# EAGLE design ARTIC_R2_Module_Breakout (EAGLE 9.6.2)
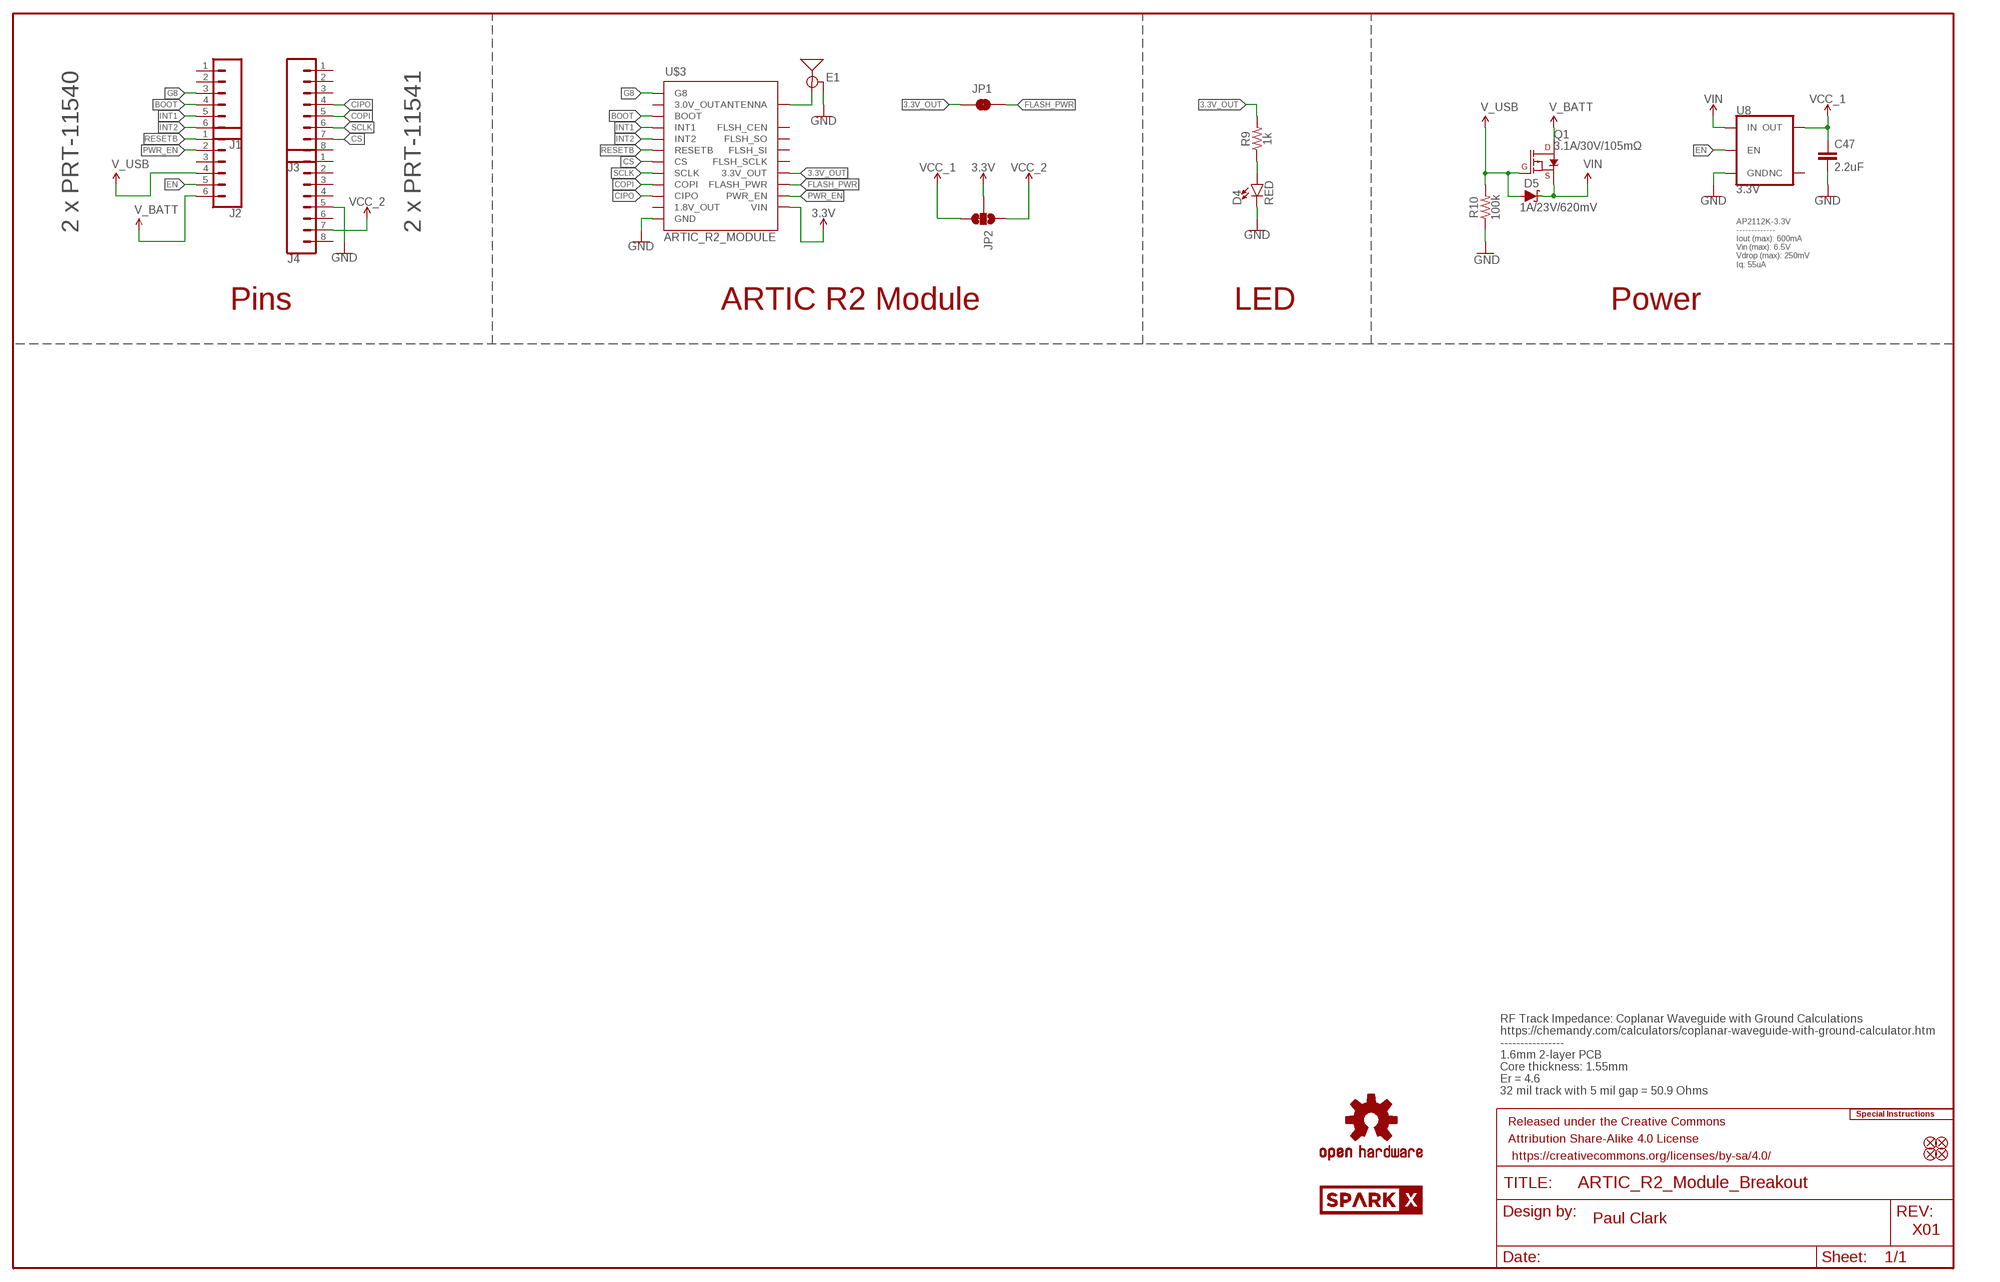
[diagram p0: schematic, sheet 1]

## Parts
C47  2.2uF  2.2UF-0402_TIGHT-10V-10%-X5R  [0402-TIGHT]
D4  RED  LED-RED0603  [LED-0603]
D5  1A/23V/620mV  DIODE-SCHOTTKY-BAT20J  [SOD-323]
E1  ANTENNA-SMA-GROUNDEDEDGE_SMA_SMD  [SMA-EDGE-SMD]
FD1  FIDUCIAL1X2  [FIDUCIAL-1X2]
FD2  FIDUCIAL1X2  [FIDUCIAL-1X2]
FD3  FIDUCIAL1X2  [FIDUCIAL-1X2]
FD4  FIDUCIAL1X2  [FIDUCIAL-1X2]
FRAME1  FRAME-LEDGER  [CREATIVE_COMMONS]
J1  CONN_06SMD_MALE  [1X06_SMD_MALE]
J2  CONN_06SMD_MALE  [1X06_SMD_MALE]
J3  CONN_08SMD-MALE  [1X08_SMD_MALE]
J4  CONN_08SMD-MALE  [1X08_SMD_MALE]
JP1  JUMPER-SMT_2_NC_TRACE_SILK  [SMT-JUMPER_2_NC_TRACE_SILK]
JP2  JUMPER-SMT_3_1-NC_TRACE_SILK  [SMT-JUMPER_3_1-NC_TRACE_SILK]
LOGO1  SPECIAL_INSTRUCTIONS-ORDERING  [ORDERING_INSTRUCTIONS]
LOGO2  OSHW-LOGOS  [OSHW-LOGO-S]
LOGO3  OSHW-LOGOS  [OSHW-LOGO-S]
Q1  3.1A/30V/105mΩ  MOSFET_PCH-DMG2307L  [SOT23-3]
R9  1k  1KOHM-0402T-1/16W-1%  [0402-TIGHT]
R10  100k  100KOHM-0402T-1/16W-1%  [0402-TIGHT]
SPARKX2  SPARKX-LOGO4  [SPARKX-MEDIUM]
U8  3.3V  V_REG_AP2112K-3.3V  [SOT23-5]
U$3  ARTIC_R2_MODULE  [ARTIC_R2_MODULE]

## Nets
3.3V: JP2.2 U$3.14(VIN)
3.3V_OUT: JP1.1 R9.2 U$3.17(3.3V_OUT)
ANTENNA: E1.SIG(SIGNAL) U$3.23(ANTENNA)
BOOT: J1.4 U$3.3(BOOT)
CIPO: J3.4 U$3.10(CIPO)
COPI: J3.5 U$3.9(COPI)
CS: J3.7 U$3.7(CS)
EN: J2.5 U8.3(EN)
FLASH_PWR: JP1.2 U$3.16(FLASH_PWR)
G8: J1.3 U$3.1(G8)
GND: C47.2 D4.C E1.GND@0(GND) E1.GND@1(GND) J4.5 R10.1 U8.2(GND) U$3.12(GND) U$3.13(GND) U$3.22(GND) U$3.24(GND)
INT1: J1.5 U$3.4(INT1)
INT2: J1.6 U$3.5(INT2)
N$22: D4.A R9.1
PWR_EN: J2.2 U$3.15(PWR_EN)
RESETB: J2.1 U$3.6(RESETB)
SCLK: J3.6 U$3.8(SCLK)
V_BATT: J2.6 Q1.3(D)
V_USB: D5.A J2.4 Q1.1(G) R10.2
VCC_1: C47.1 JP2.3 U8.5(OUT)
VCC_2: J4.7 JP2.1
VIN: D5.C Q1.2(S) U8.1(IN)
Unconnected: J1.1 J1.2 J2.3 J3.1 J3.2 J3.3 J3.8 J4.1 J4.2 J4.3 J4.4 J4.6 J4.8 U8.4(NC) U$3.2(3.0V_OUT) U$3.11(1.8V_OUT) U$3.18(FLSH_SCLK) U$3.19(FLSH_SI) U$3.20(FLSH_SO) U$3.21(FLSH_CEN)

## Notes on the sheet
- AP2112K-3.3V
  -------------
  Iout (max): 600mA 
  Vin (max): 6.5V
  Vdrop (max): 250mV
  Iq: 55uA
- 2 x PRT-11540 | 2 x PRT-11541
- Pins | ARTIC R2 Module | LED | Power
- RF Track Impedance: Coplanar Waveguide with Ground Calculations
  https://chemandy.com/calculators/coplanar-waveguide-with-ground-calculator.htm
  ----------------
  1.6mm 2-layer PCB
  Core thickness: 1.55mm
  Er = 4.6
  32 mil track with 5 mil gap = 50.9 Ohms
- Paul Clark
- X01

## Library data of the parts
C47 = SparkFun-Capacitors:2.2UF: 2.2µF ceramic capacitors A capacitor is a passive two-terminal electrical component used to store electrical energy temporarily in an electric field.; PROD_ID: CAP-14232
D4 = SparkFun-LED:LED-RED: Red SMD LED Used in manufacturing of most products at SparkFun Packages: 0603 - SMD 0603 package [Product Link] <http://docs.avagotech.com/docs/AV02-0551EN> 0603 SMART - SMD 0603 SMART package ( more efficient and expensive)[Product Link] <http://www.osram-os.com/Graphics/XPic2/00077099_0.pdf> 1206 - SMD1206 package [Product Link] <https://www.sparkfun.com/datasheets/DevTools/LilyPad/Q150OVS4.pdff> SparkFun Products: Pro Mini 328 -5V <https://www.sparkfun.com/products/821> RedBoard <https://www.sparkfun.com/products/12757> IOIO-OTG <https://www.sparkfun.com/products/13613>; PROD_ID: DIO-00819
D5 = SparkFun-DiscreteSemi:DIODE-SCHOTTKY: Schottky diode A Schottky diode is a semiconductor diode which has a low forward voltage drop and a very fast switching action.; PROD_ID: DIO-11623
E1 = SparkFun-RF:ANTENNA-SMA-GROUNDED: SMA Antenna Connector w/ Ground Edge-mount and SMD SMA connectors for RF Antennas. **4-LAYER BOARD WARNING!!** When designing a 4-layer board using any of the SMD variants, you will need to manually add a cutout polygon on any internal power layers to make sure that you don't end up with exposed copper around the edge of the routed hole for these connectors. Exposed power copper could then short to the connector body - and that would be bad. Why hasn't anyone added the cutout polygons directly to the connector footprint? Well, your internal layers (usually 2 and 15) may be covered with GND polygons and you might well want the copper to go all the way to the edge, especially under the connector SIGNAL pin. So adding cutouts to the footprint might make matters worse, not better...; PROD_ID: CONN-15100
FD1-FD4 = SparkFun-Aesthetics:FIDUCIAL: Fiducial Alignment Points Point-of-reference for pick-and-place machines and other optical instruments.
FRAME1 = SparkFun-Aesthetics:FRAME-LEDGER: Schematic Frame - Ledger Standard 11x14 US Ledger frame
J1 J2 = Connectors:CONN_06: Multi connection point. Often used as Generic Header-pin footprint for 0.1 inch spaced/style header connections On any of the 0.1 inch spaced packages, you can populate with these: Break Away Headers - Straight <https://www.sparkfun.com/products/116> (PRT-00116) Break Away Male Headers - Right Angle <https://www.sparkfun.com/products/553> (PRT-00553) Female Headers <https://www.sparkfun.com/products/115> (PRT-00115) Break Away Headers - Machine Pin <https://www.sparkfun.com/products/117> (PRT-00117) Break Away Female Headers - Swiss Machine Pin <https://www.sparkfun.com/products/743> (PRT-00743) Arduino Stackable Header - 6 Pin <https://www.sparkfun.com/products/9280> (PRT-09280) For SCREWTERMINALS and SPRING TERMINALS visit here: Screw Terimnals on SparkFun.com <https://www.sparkfun.com/search/results?term=Screw+Terminals> (5mm/3.5mm/2.54mm spacing) This device is also useful as a general connection point to wire up your design to another part of your project. Our various solder wires solder well into these plated through hole pads. Hook-Up Wire - Assortment (Stranded, 22 AWG) <https://www.sparkfun.com/products/11375> (PRT-11375) Hook-Up Wire - Assortment (Solid Core, 22 AWG) <https://www.sparkfun.com/products/11367> (PRT-11367) View the entire wire category on our website here <https://www.sparkfun.com/categories/141>; PROD_ID: PRT-11540
J3 J4 = Connectors:CONN_08: Multi connection point. Often used as Generic Header-pin footprint for 0.1 inch spaced/style header connections On any of the 0.1 inch spaced packages, you can populate with these: Break Away Headers - Straight <https://www.sparkfun.com/products/116> (PRT-00116) Break Away Male Headers - Right Angle <https://www.sparkfun.com/products/553> (PRT-00553) Female Headers <https://www.sparkfun.com/products/115> (PRT-00115) Break Away Headers - Machine Pin <https://www.sparkfun.com/products/117> (PRT-00117) Break Away Female Headers - Swiss Machine Pin <https://www.sparkfun.com/products/743> (PRT-00743) Arduino Stackable Header - 8 Pin <https://www.sparkfun.com/products/9279> (PRT-09279) For SCREWTERMINALS and SPRING TERMINALS visit here: Screw Terimnals on SparkFun.com <https://www.sparkfun.com/search/results?term=Screw+Terminals> (5mm/3.5mm/2.54mm spacing) This device is also useful as a general connection point to wire up your design to another part of your project. Our various solder wires solder well into these plated through hole pads. Hook-Up Wire - Assortment (Stranded, 22 AWG) <https://www.sparkfun.com/products/11375> (PRT-11375) Hook-Up Wire - Assortment (Solid Core, 22 AWG) <https://www.sparkfun.com/products/11367> (PRT-11367) View the entire wire category on our website here <https://www.sparkfun.com/categories/141> Special notes: Molex polarized connector foot print use with SKU : PRT-08231 with associated crimp pins and housings. 1MM SMD Version SKU: PRT-10208 NOTES ON THE VARIANTS LOCK and LOCK_LONGPADS... This footprint was designed to help hold the alignment of a through-hole component (i.e. 6-pin header) while soldering it into place. You may notice that each hole has been shifted either up or down by 0.005 of an inch from it's more standard position (which is a perfectly straight line). This slight alteration caused the pins (the squares in the middle) to touch the edges of the holes. Because they are alternating, it causes a "brace" to hold the component in place. 0.005 has proven to be the perfect amount of "off-center" position when using our standard breakaway headers. Although looks a little odd when you look at the bare footprint, once you have a header in there, the alteration is very hard to notice. Also,if you push a header all the way into place, it is covered up entirely on the bottom side.; PROD_ID: PRT-11541
JP1 = SparkFun-Jumpers:JUMPER-SMT_2_NC_TRACE: Normally closed trace jumper This jumper has a trace between two pads so it's normally closed (NC). Use a razor knife to open the connection. For best results follow the IPC guidelines for cutting traces: Cutout at least 0.063 mm (0.005 in). Remove all loose material to clean up the cut area. Seal the cut with an approved epoxy. Reapply solder to reclose the connection.
JP2 = SparkFun-Jumpers:JUMPER-SMT_3_1-NC_TRACE: Normally closed trace jumper (1 of 2 connections) This jumper has a trace between two pads so it's normally closed (NC). The other connection is normally open (NO). Use a razor knife to open the connection. For best results follow the IPC guidelines for cutting traces: Cutout at least 0.063 mm (0.005 in). Remove all loose material to clean up the cut area. Seal the cut with an approved epoxy. Reapply solder to reclose the connection, or to close the NO connection.
LOGO1 = SparkFun-Aesthetics:SPECIAL_INSTRUCTIONS: Special Ordering/Production Instructions Alert Symbol for special PCB ordering instructions or unique production process warnings. Ordering Instructions Production Instructions Types of information that should be added to box: Copper weight Soldermask color Silk color PCB thickness Number of layers PCB Standard: 1.6mm FR4 1 oz copper immersion silver plating red soldermask white silkscreen Types of information that should be added to box: Special wash requirements Depaneling instructions Humidification Glue curing Default text settings: 0.07 inch 9% ratio 50% line distance
LOGO2 LOGO3 = SparkFun-Aesthetics:OSHW-LOGO: Open-Source Hardware (OSHW) Logo This logo indicates the piece of hardware it is found on incorporates a OSHW license and/or adheres to the definition of open source hardware found here: http://freedomdefined.org/OSHW
Q1 = SparkFun-DiscreteSemi:MOSFET_PCH: P-channel MOSFETs Voltage controlled devices that allow control of high current outputs. SparkFun Products: SparkFun ESP32 Thing <https://www.sparkfun.com/products/13907> SparkFun ESP8266 Thing <https://www.sparkfun.com/products/13231> SparkFun Pi Servo HAT V2 <https://www.sparkfun.com/products/15316> DMG2305UX-7 (20V/4.2A/SOT23-3); PROD_ID: TRANS-11308
R9 = SparkFun-Resistors:1KOHM: 1kΩ resistor A resistor is a passive two-terminal electrical component that implements electrical resistance as a circuit element. Resistors act to reduce current flow, and, at the same time, act to lower voltage levels within circuits. - Wikipedia; PROD_ID: RES-14342
R10 = SparkFun-Resistors:100KOHM: 100kΩ resistor A resistor is a passive two-terminal electrical component that implements electrical resistance as a circuit element. Resistors act to reduce current flow, and, at the same time, act to lower voltage levels within circuits. - Wikipedia; PROD_ID: RES-13495
SPARKX2 = SparkX:SPARKX-LOGO
U8 = SparkFun-IC-Power:V_REG_AP2112: AP2112 - 600mA CMOS LDO Regulator w/ Enable The AP2112 is CMOS process low dropout linear regulator with enable function, the regulator delivers a guaranteed 600mA (min.) continuous load current. Features Output Voltage Accuracy: ±1.5% Output Current: 600mA (Min.) Foldback Short Current Protection: 50mA Enable Function to Turn ON/OFF VOUT Low Dropout Voltage (3.3V): 250mV (Typ.) @IOUT=600mA Excellent Load Regulation: 0.2%/A (Typ.) Excellent Line Regulation: 0.02%/V (Typ.) Low Quiescent Current: 55μA (Typ.) Low Standby Current: 0.01μA (Typ.) Low Output Noise: 50μVRMS PSRR: 100Hz -65dB, 1kHz -65dB OTSD Protection Stable with 1.0μF Flexible Cap: Ceramic, Tantalum and Aluminum Electrolytic Operation Temperature Range: -40°C to 85°C ESD: MM 400V, HBM 4000V; PROD_ID: VREG-12457
U$3 = ARTIC_R2_Module:ARTIC_R2_MODULE: ARTIC R2 Castellated Module

## Net classes
1 Power: width 0.305 mm

## Board
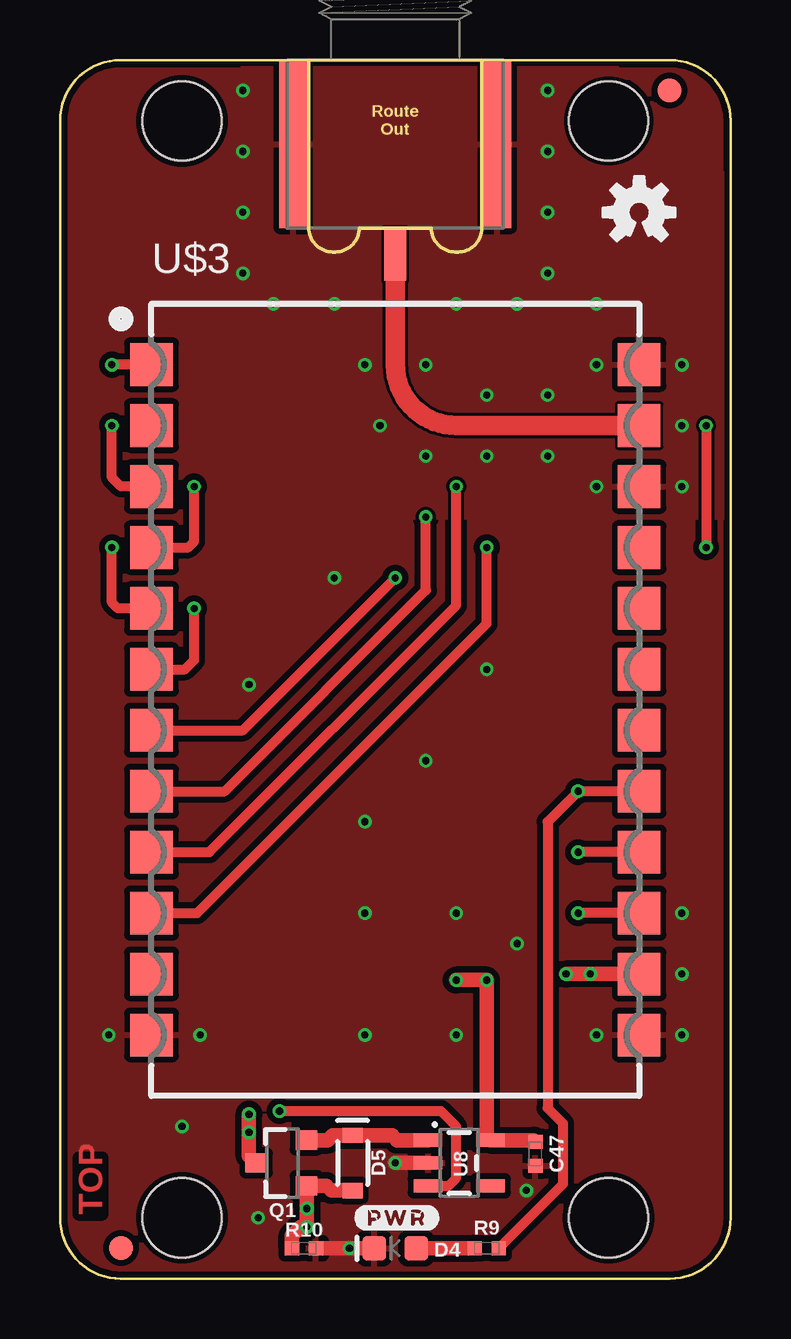
[diagram p1: board, top side]
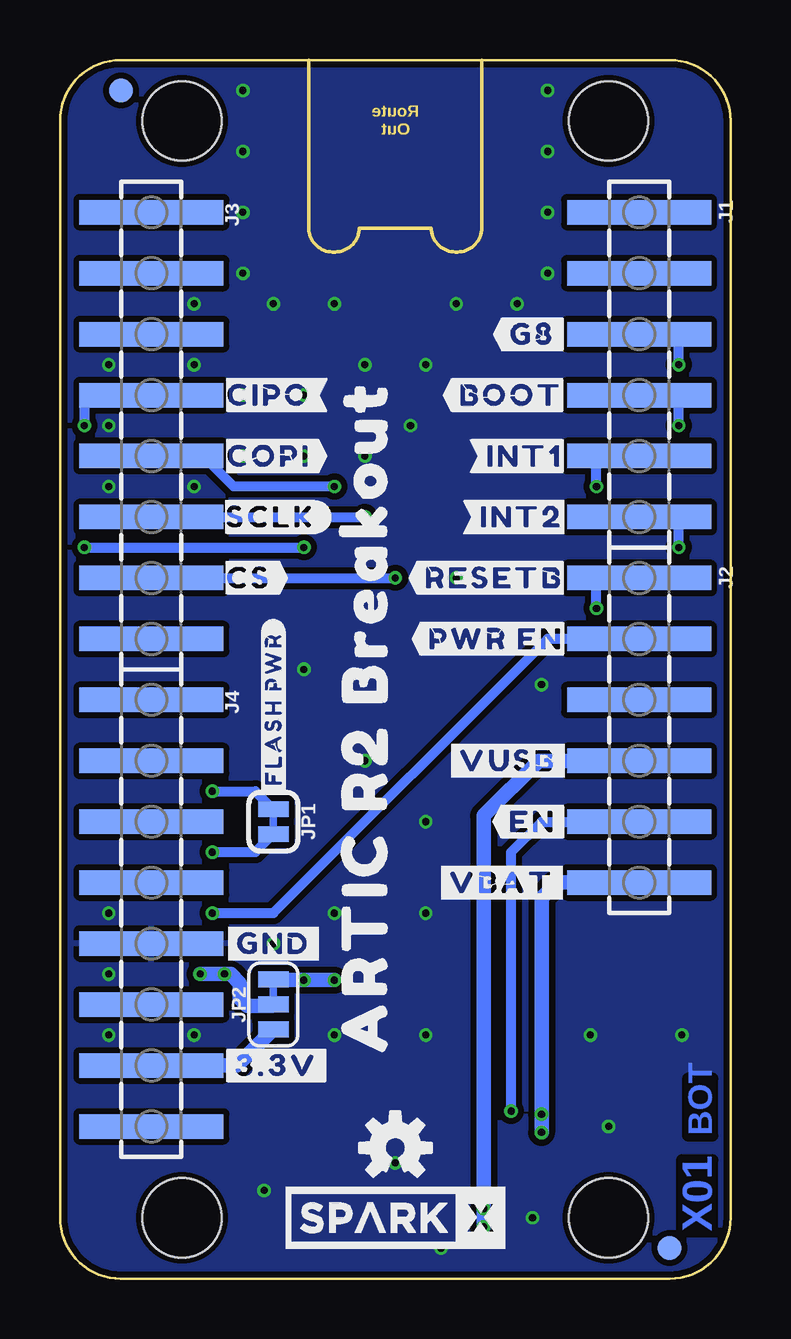
[diagram p2: board, bottom side, seen from below]

Size 27.94 x 50.8 mm. Coordinates in mm from the lower left corner, seen from the top.
Outline: 0,48.26 0,2.54 arc90 2.54,0 25.4,0 arc90 27.94,2.54 27.94,48.26 arc90 25.4,50.8 2.54,50.8 arc90 0,48.26
Copper layers (1+2*15+16): Top 0.035mm / dielectric 0.2mm / Route2 0.0175mm / dielectric 1.065mm / Route15 0.0175mm / dielectric 0.2mm / Bottom 0.035mm
Design rules "SparkFun-4-layer-1oz-JLCPCB": minimum track width 5mil, minimum drill 0.2mm, track to track 5mil, track to pad 0.2mm, pad to pad 5mil, via to via 0.2mm, smd to smd 0mil, copper to edge 0.2mm, drill to drill 10mil, minimum pad ring 0.13mm, minimum via ring 0.13mm, stop-mask expansion 0.05mm, vias tented up to drill 25mil, thermal gap 10mil
Holes 3.3 mm at 5.08,2.54 22.86,2.54 22.86,48.26 5.08,48.26

### Footprints (pad centres in the part's own frame; a part is rotated, then mirrored left to right if it is on the bottom)
0402-TIGHT = smd 0.6 x 0.6: 1 -0.5,0; 2 0.5,0
LED-0603 = smd 1 x 1: A -0.877,0; C 0.877,0
SOD-323 = smd 0.63 x 0.83: A 1.15,0; C -1.15,0
SMA-EDGE-SMD = smd 1.15 x 7: GND@0 -4.25,-3.5; GND@1 4.25,-3.5 | smd 0.9 x 2.2: SIG 0,-8.1
FIDUCIAL-1X2 = smd 1 x 1: 1 0,0
1X06_SMD_MALE = smd 1.02 x 6: 1 0,0; 2 2.54,0; 3 5.08,0; 4 7.62,0; 5 10.16,0; 6 12.7,0
1X08_SMD_MALE = smd 1.02 x 6: 1 0,0; 2 2.54,0; 3 5.08,0; 4 7.62,0; 5 10.16,0; 6 12.7,0; 7 15.24,0; 8 17.78,0
SMT-JUMPER_2_NC_TRACE_SILK = smd 0.66 x 1.27: 1 -0.521,0; 2 0.521,0
SMT-JUMPER_3_1-NC_TRACE_SILK = smd 0.66 x 1.27: 1 -1.041,0; 2 0,0; 3 1.041,0
SOT23-3 = smd 0.8 x 0.9: 1 -0.95,-1; 2 0.95,-1; 3 0,1.1
SOT23-5 = smd 0.55 x 1.2: 1 -0.95,-1.3; 2 0,-1.3; 3 0.95,-1.3; 4 0.95,1.3; 5 -0.95,1.3
ARTIC_R2_MODULE = smd 1.778 x 1.778: 1 -10.16,13.97; 2 -10.16,11.43; 3 -10.16,8.89; 4 -10.16,6.35; 5 -10.16,3.81; 6 -10.16,1.27; 7 -10.16,-1.27; 8 -10.16,-3.81; 9 -10.16,-6.35; 10 -10.16,-8.89; 11 -10.16,-11.43; 12 -10.16,-13.97; 13 10.16,-13.97; 14 10.16,-11.43; 15 10.16,-8.89; 16 10.16,-6.35; 17 10.16,-3.81; 18 10.16,-1.27; 19 10.16,1.27; 20 10.16,3.81; 21 10.16,6.35; 22 10.16,8.89; 23 10.16,11.43; 24 10.16,13.97

### Placement (x,y rotation side)
C47  19.81,5.21 270 top
D4  13.97,1.27 180 top
D5  12.19,4.83 270 top
E1  13.97,50.8 0 top
FD1  25.4,49.53 0 top
FD2  25.4,49.53 0 bottom
FD3  2.54,1.27 0 top
FD4  2.54,1.27 0 bottom
FRAME1  58.42,-10.16 0 top  (outside the outline)
J1  3.81,44.45 270 bottom
J2  3.81,29.21 270 bottom
J3  24.13,44.45 270 bottom
J4  24.13,24.13 270 bottom
JP1  19.05,19.05 270 bottom
JP2  19.05,11.43 90 bottom
LOGO1  31.75,50.8 0 top  (outside the outline)
LOGO2  24.13,44.45 0 top
LOGO3  13.97,5.46 0 bottom
Q1  9.27,4.83 90 top
R9  17.78,1.27 0 top
R10  10.16,1.27 180 top
SPARKX2  13.97,2.54 0 bottom
U8  16.64,4.83 270 top
U$1  [#GND#0]  19.05,13.97 0 bottom
U$2  [#3#3V#0]  18.92,8.89 0 bottom
U$3  13.97,24.13 0 top
U$4  [#FLASH_PWR#0]  19.05,23.75 90 bottom
U$5  [#VBAT#0]  9.53,16.51 0 bottom
U$6  [#G8#0]  8.26,39.37 0 bottom
U$7  [#EN#0]  8.26,19.05 0 bottom
U$8  [#VUSB#0]  9.27,21.59 0 bottom
U$9  [CIPO#0]  19.24,36.83 0 bottom
U$12  [COPI#0]  19.24,34.29 0 bottom
U$14  [SCLK#0]  19.18,31.75 0 bottom
U$16  [CS#0]  20.07,29.21 0 bottom
U$18  [#RESETB0]  9.84,29.21 0 bottom
U$19  [#PWR_EN0]  9.78,26.67 0 bottom
U$24  [#BOOT0]  9.14,36.83 0 bottom
U$25  [#INT10]  8.57,34.29 0 bottom
U$26  [#INT20]  8.7,31.75 0 bottom
U$28  [#PWR#0]  14.03,2.54 0 top
U$29  [ARTIC_R2_BREAKOUT0]  15.24,23.5 90 bottom

### Tracks (layer width: path | path; a pad name or v marks a point on that pad's centre or on a via)
3.3V  (via drill 0.3)
  Top 0.61: U$3.14 v21.09,12.7
  Bottom 0.61: JP2.2 19.1,11.38 20.15,11.38 20.45,11.68 20.45,12.32 20.83,12.7 v21.09,12.7 v22.1,12.7
3.3V_OUT  (via drill 0.3)
  Top 0.406: U$3.17 v21.59,20.32 20.32,19.05 20.32,7.11 20.95,6.48 20.95,3.94 R9.2
  Bottom 0.406: v21.59,20.32 19.8,20.32 JP1.1
ANTENNA
  Top 0.813: E1.SIG 13.97,38.1 arc90 16.51,35.56 U$3.23
BOOT  (via drill 0.3)
  Top 0.406: v2.16,35.56 2.16,33.4 2.54,33.02 U$3.3
  Bottom 0.406: v2.16,35.56 2.16,36.45 2.54,36.83 J1.4
CIPO  (via drill 0.3)
  Top 0.406: v17.78,30.48 17.78,27.3 5.71,15.24 U$3.10 | v26.92,35.56 v26.92,30.48
  Bottom 0.406: J3.4 26.54,36.83 26.92,36.45 v26.92,35.56 | v26.92,30.48 v17.78,30.48
COPI  (via drill 0.3)
  Top 0.406: v16.51,33.02 16.51,28.07 6.22,17.78 U$3.9
  Bottom 0.406: v16.51,33.02 20.7,33.02 21.59,33.91 21.59,34.29 J3.5
CS  (via drill 0.3)
  Top 0.406: v13.97,29.21 7.62,22.86 U$3.7
  Bottom 0.406: J3.7 v13.97,29.21
EN  (via drill 0.3)
  Top 0.406: U8.3 16.2,3.88 16.51,4.19 16.51,6.35 15.88,6.99 v9.14,6.99
  Bottom 0.406: v9.14,6.99 9.14,17.78 7.87,19.05 J2.5
FLASH_PWR  (via drill 0.3)
  Top 0.406: U$3.16 v21.59,17.78
  Bottom 0.406: v21.59,17.78 19.8,17.78 JP1.2
G8  (via drill 0.3)
  Top 0.406: U$3.1 v2.16,38.1
  Bottom 0.406: v2.16,38.1 2.16,39.12 2.41,39.37 J1.3
GND  (via drill 0.3)
  Top 0.61: R10.1 v12.06,1.27 D4.C | U8.2 v13.97,4.83
  other vias: 22.35,33.02 25.91,33.02 22.35,10.16 25.91,10.16 22.35,38.1 25.91,38.1 25.91,35.56 22.35,40.64 15.24,38.1 17.78,36.83 20.32,41.91 19.05,40.64 16.51,40.64 12.7,38.1 11.43,40.64 20.32,44.45 20.32,46.99 20.32,49.53 7.62,49.53 7.62,46.99 7.62,44.45 7.62,41.91 8.89,40.64 13.34,35.56 15.24,34.29 17.78,34.29 20.32,34.29 20.32,36.83 2.03,10.16 5.84,10.16 25.91,12.7 25.91,15.24 8.26,2.54 19.43,3.68 11.43,29.21 17.78,25.4 15.24,21.59 12.7,19.05 7.87,24.77 16.51,10.16 12.7,10.16 5.08,6.35 12.7,15.24 16.51,15.24 19.05,13.97
  pour Top (isolate 0.254, rank 3): 0,50.8 27.94,50.8 27.94,0 0,0
  pour Bottom (isolate 0.254, rank 2): 0,50.8 27.94,50.8 27.94,0 0,0
  pour Top (isolate 0.127): 7.62,50.8 7.62,38.1 13.97,31.75 27.94,31.75 27.94,45.72 22.86,50.8
INT1  (via drill 0.3)
  Top 0.406: v5.59,33.02 5.59,30.73 5.33,30.48 U$3.4
  Bottom 0.406: v5.59,33.02 5.59,33.91 5.71,34.04 5.46,34.29 J1.5
INT2  (via drill 0.3)
  Top 0.406: v2.16,30.48 2.16,28.19 2.41,27.94 U$3.5
  Bottom 0.406: v2.16,30.48 2.16,31.37 2.54,31.75 J1.6
N$22
  Top 0.61: D4.A R9.1
PWR_EN  (via drill 0.3)
  Top 0.406: U$3.15 v21.59,15.24
  Bottom 0.406: v21.59,15.24 19.05,15.24 7.62,26.67 J2.2
RESETB  (via drill 0.3)
  Top 0.406: v5.59,27.94 5.59,25.78 5.21,25.4 U$3.6
  Bottom 0.406: v5.59,27.94 5.59,28.83 5.71,28.96 5.46,29.21 J2.1
SCLK  (via drill 0.3)
  Top 0.406: v15.24,31.75 15.24,28.7 6.86,20.32 U$3.8
  Bottom 0.406: J3.6 v15.24,31.75
V_BATT  (via drill 0.3)
  Top 0.61: Q1.3 7.87,5.12 v7.87,6.86
  Bottom 0.61: J2.6 7.24,16.51 7.87,15.88 v7.87,6.86 v7.87,6.1
V_USB  (via drill 0.3)
  Top 0.61: D5.A 11.3,3.68 11.1,3.88 Q1.1 10.29,3.86 v10.29,2.92 v10.29,2.16 10.03,2.16 9.66,1.79 R10.2
  Bottom 0.61: J2.4 8,21.59 10.29,19.3 v10.29,2.92 v10.29,2.16
VCC_1  (via drill 0.3)
  Top 0.61: v16.51,12.45 v17.78,12.45 17.78,5.93 U8.5 19.74,5.78 C47.1
  Bottom 0.61: v16.51,12.45 v17.78,12.45 19.02,12.45 JP2.3
VCC_2
  Bottom 0.61: J4.7 20.55,8.89 JP2.1
VIN
  Top 0.61: U8.1 14.04,5.78 13.84,5.98 D5.C 11.36,5.98 11.16,5.78 Q1.2

### Text on the board
Top: TOP
Bottom: BOT | X01
Measures: Dimensions in Inches
tDocu: 2-Layer Board / 1.6mm Thickness / 1oz Copper (Outer layers) / HASL Finish | Paul Clark